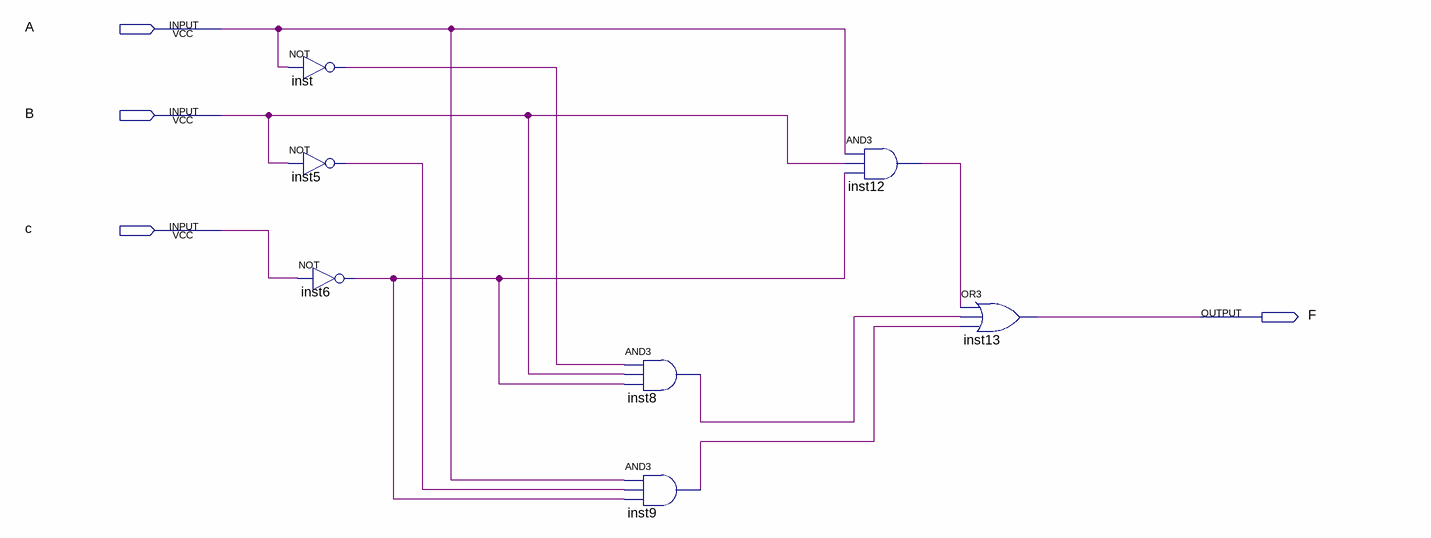
[diagram p0: schematic sheet]
// Quartus schematic lab2step1.bdf as structural Verilog: 7 symbols, 4 pins
module lab2step1 (
  input  A,
  input  B,
  input  c,
  output F
);

  wire inst5_out, inst6_out, inst8_out, inst9_out, inst12_out, inst_out;

  not inst (inst_out, A);
  not inst5 (inst5_out, B);
  not inst6 (inst6_out, c);
  and inst8 (inst8_out, inst_out, B, inst6_out);
  and inst9 (inst9_out, A, inst5_out, inst6_out);
  and inst12 (inst12_out, A, B, inst6_out);
  or inst13 (F, inst12_out, inst8_out, inst9_out);
endmodule
